# Altium schematic sheet 自平衡小车原理图.SchDoc: 自平衡小车
size A3; Author: 陈蔚
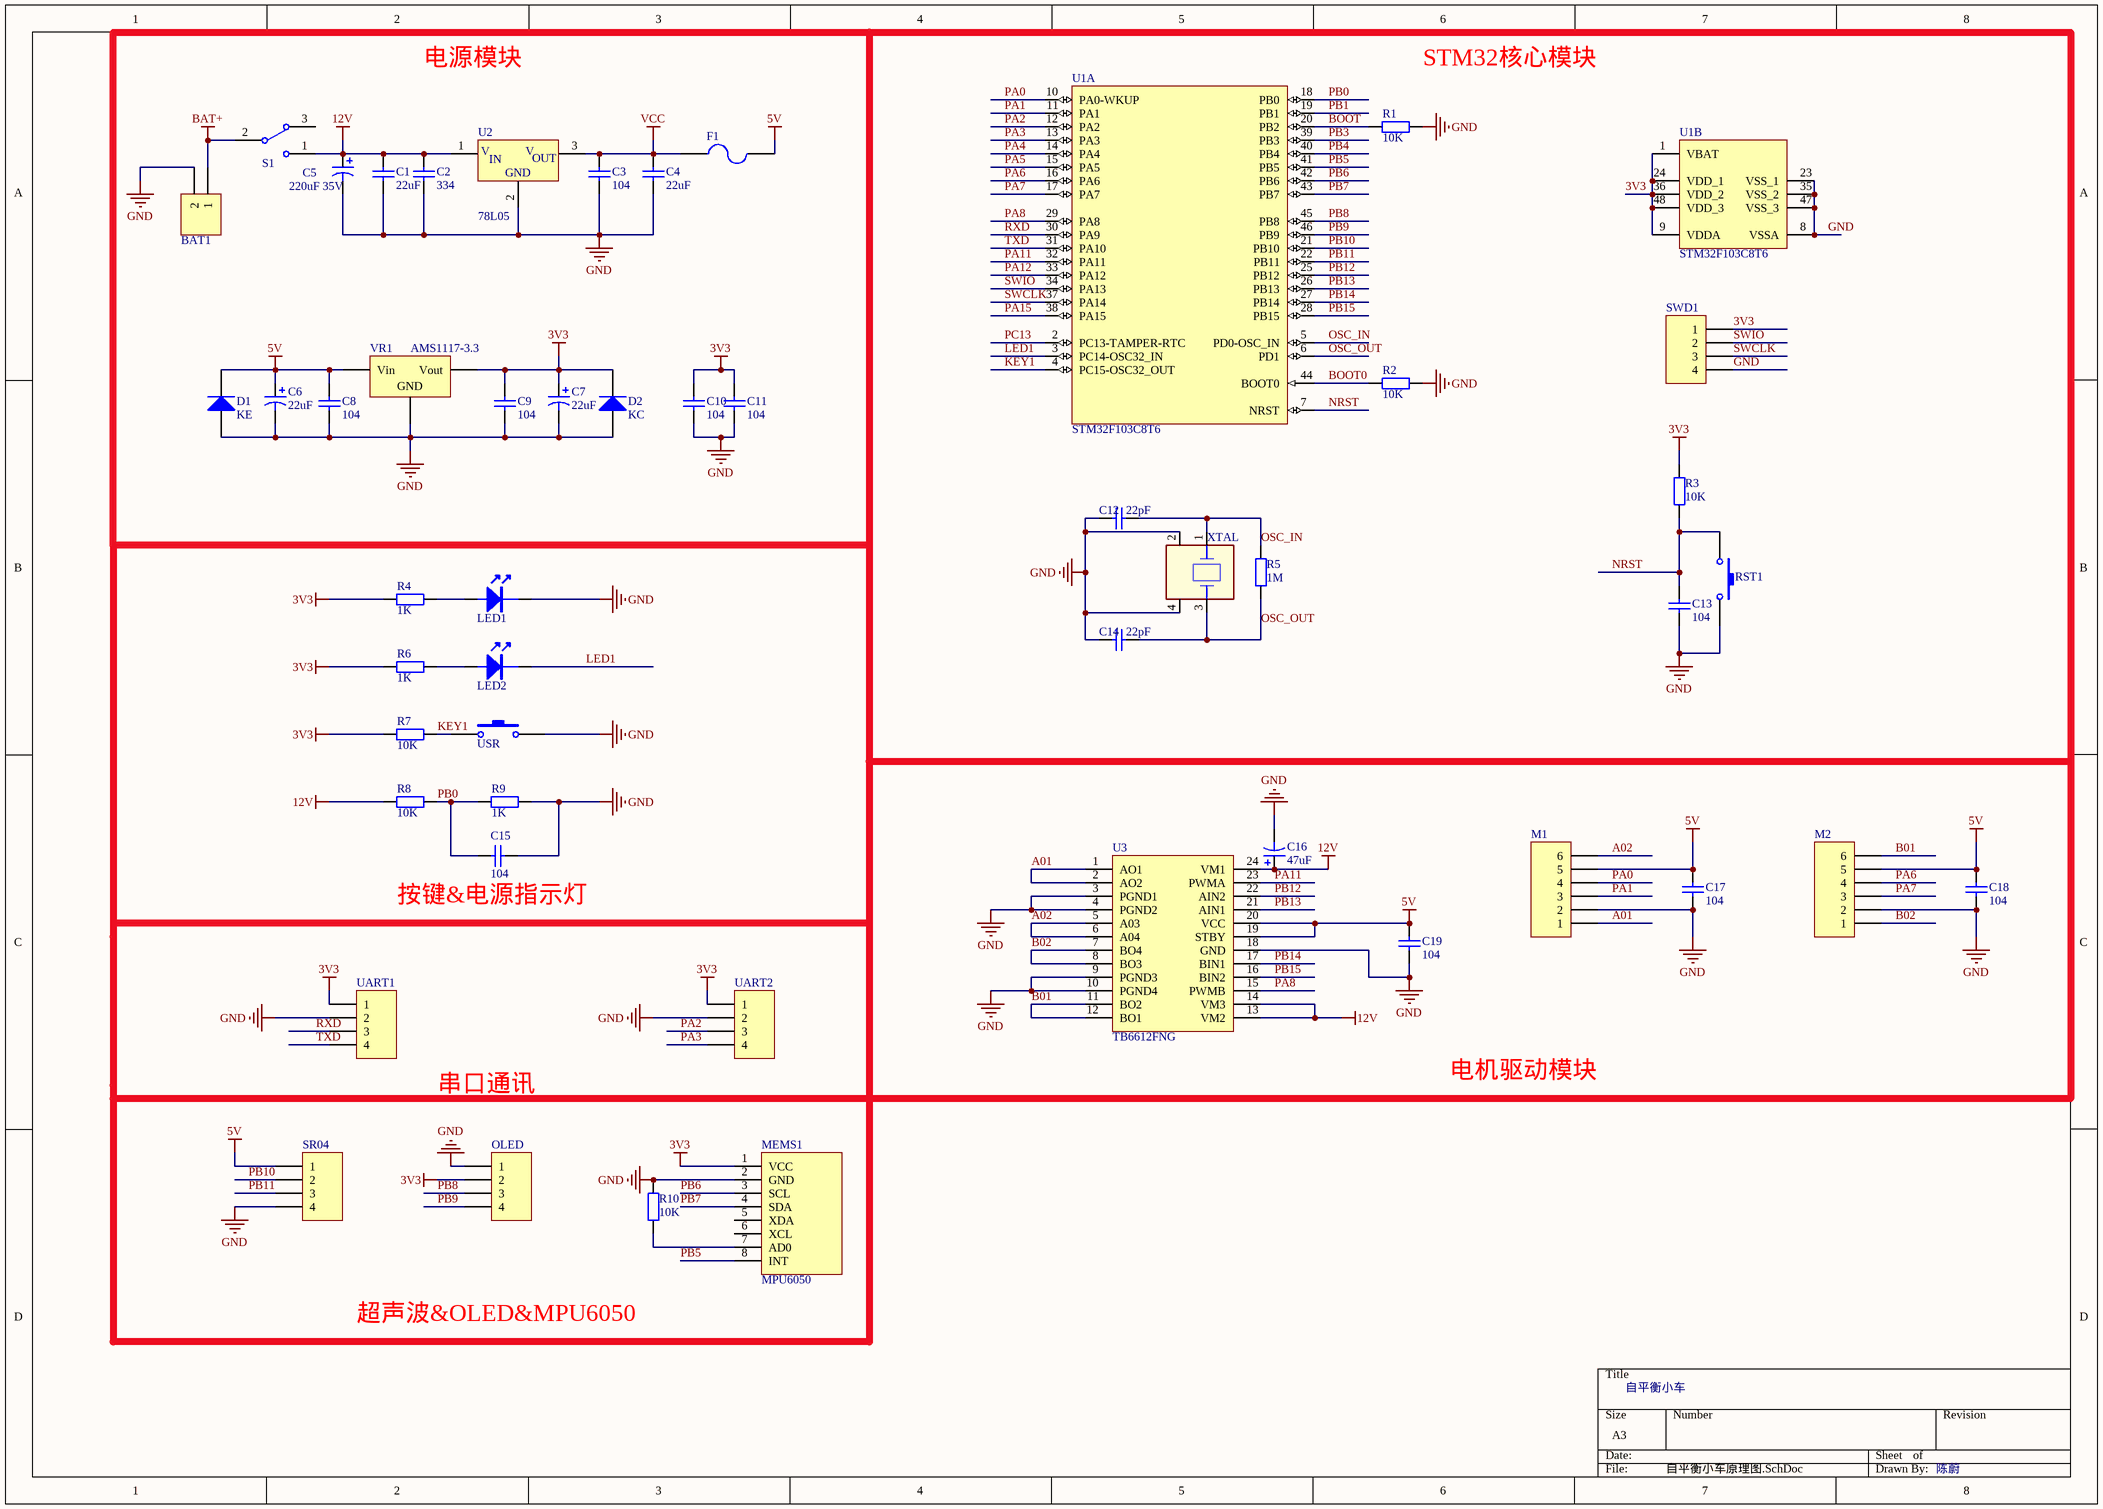
[diagram p0: 自平衡小车原理图.SchDoc]

## Parts
BAT1  Header 2  [XT30-PW-M]  (value not drawn)
C1  22uF  [0603_C_f]
C2  334  [0603_C_f]
C3  104  [0603_C_f]
C4  22uF  [0603_C_f]
C5  220uF 35V  [CM E(8*10.2)]
C6  value 22uF  [CD A(3216)]  (hidden comment: T22uF)
C7  value 22uF  [CD A(3216)]  (hidden comment: T22uF)
C8  104  [0603_C_f]
C9  104  [0603_C_f]
C10  104  [0603_C_f]
C11  104  [0603_C_f]
C12  22pF  [0603_C_f]
C13  104  [0603_C_f]
C14  22pF  [0603_C_f]
C15  104  [0603_C_f]
C16  47uF  [CM D(6.3*7.7)]
C17  104  [0603_C_f]
C18  104  [0603_C_f]
C19  104  [0603_C_f]
D1  KE  [SMB]
D2  KC  [SMB]
F1  F1  [0805_R]  (value not drawn)
LED1  LED  [LED-0603_GREEN]  (value not drawn)
LED2  LED  [LED-0603_GREEN]  (value not drawn)
M1  Header 6  [XH2.54-WI-6P]  (value not drawn)
M2  Header 6  [XH2.54-WI-6P]  (value not drawn)
MEMS1  MPU6050  [MPU6050]
OLED  Header 4  [HDR1X4]  (value not drawn)
R1  10K  [0603_R_F]
R2  10K  [0603_R_F]
R3  10K  [0603_R_F]
R4  1K  [0603_R_F]
R5  1M  [0603_R_F]
R6  1K  [0603_R_F]
R7  10K  [0603_R_F]
R8  10K  [0603_R_F]
R9  1K  [0603_R_F]
R10  10K  [0603_R_F]
RST1  SW-PB  [KEY]  (value not drawn)
S1  SW-SPDT  [SW-TH_SK-12D02-VG5]  (value not drawn)
SR04  Header 4  [HDR1X4]  (value not drawn)
SWD1  Header 4  [HDR1X4]  (value not drawn)
U1  STM32F103C8T6  [LQFP48 7X7_N]  (parts A,B of 2)
U2  78L05  [TO252]
U3  TB6612FNG  [SSOP-24_208mil]
UART1  Header 4  [HDR1X4]  (value not drawn)
UART2  Header 4  [HDR1X4]  (value not drawn)
USR  SW-PB  [KEY]  (value not drawn)
VR1  AMS1117-3.3  [SOT223_N]
XTAL  XTAL-4P  [OSC 3225-4P]  (value not drawn)

## Nets
3V3: C7.1 C9.2 C10.2 C11.2 D2.2(K) MEMS1.1(VCC) OLED.2 R3.2 R4.1 R6.1 R7.1 SWD1.1 U1.1(VBAT) U1.9(VDDA) U1.24(VDD_1) U1.36(VDD_2) U1.48(VDD_3) UART1.1 UART2.1 VR1.2(Vout)
5V: C6.1 C8.2 C17.2 C18.2 C19.2 D1.2(K) F1.2 M1.5 M2.5 SR04.1 U3.19(STBY) U3.20(VCC) VR1.3(Vin)
12V: C1.2 C2.2 C5.1 C16.1 R8.1 S1.1 U2.1(VIN) U3.13(VM2) U3.14(VM3) U3.24(VM1)
BAT+: BAT1.1 S1.2
GND: BAT1.2 C1.1 C2.1 C3.1 C4.1 C5.2 C6.2 C7.2 C8.1 C9.1 C10.1 C11.1 C12.1 C13.1 C14.1 C15.2 C16.2 C17.1 C18.1 C19.1 D1.1(A) D2.1(A) LED1.2 M1.2 M2.2 MEMS1.2(GND) OLED.1 R1.2 R2.2 R9.2 R10.2 RST1.2 SR04.4 SWD1.4 U1.8(VSSA) U1.23(VSS_1) U1.35(VSS_2) U1.47(VSS_3) U2.2(GND) U3.3(PGND1) U3.4(PGND2) U3.9(PGND3) U3.10(PGND4) U3.18(GND) UART1.2 UART2.2 USR.2 VR1.1(GND) XTAL.2 XTAL.4
VCC: C3.2 C4.2 F1.1 U2.3(VOUT)
A01: M1.1 U3.1(AO1) U3.2(AO2)
A02: M1.6 U3.5(A03) U3.6(A04)
B01: M2.6 U3.11(BO2) U3.12(BO1)
B02: M2.1 U3.7(BO4) U3.8(BO3)
BOOT: R1.1 U1.20(PB2)
BOOT0: R2.1 U1.44(BOOT0)
KEY1: R7.2 U1.4(PC15-OSC32_OUT) USR.1
LED1: LED2.2 U1.3(PC14-OSC32_IN)
NRST: C13.2 R3.1 RST1.1 U1.7(NRST)
OSC_IN: C12.2 R5.2 U1.5(PD0-OSC_IN) XTAL.1
OSC_OUT: C14.2 R5.1 U1.6(PD1) XTAL.3
PA0: M1.4 U1.10(PA0-WKUP)
PA1: M1.3 U1.11(PA1)
PA2: U1.12(PA2) UART2.3
PA3: U1.13(PA3) UART2.4
PA4: U1.14(PA4)
PA5: U1.15(PA5)
PA6: M2.4 U1.16(PA6)
PA7: M2.3 U1.17(PA7)
PA8: U1.29(PA8) U3.15(PWMB)
PA11: U1.32(PA11) U3.23(PWMA)
PA12: U1.33(PA12)
PA15: U1.38(PA15)
PB0: C15.1 R8.2 R9.1 U1.18(PB0)
PB1: U1.19(PB1)
PB3: U1.39(PB3)
PB4: U1.40(PB4)
PB5: MEMS1.8(INT) U1.41(PB5)
PB6: MEMS1.3(SCL) U1.42(PB6)
PB7: MEMS1.4(SDA) U1.43(PB7)
PB8: OLED.3 U1.45(PB8)
PB9: OLED.4 U1.46(PB9)
PB10: SR04.2 U1.21(PB10)
PB11: SR04.3 U1.22(PB11)
PB12: U1.25(PB12) U3.22(AIN2)
PB13: U1.26(PB13) U3.21(AIN1)
PB14: U1.27(PB14) U3.17(BIN1)
PB15: U1.28(PB15) U3.16(BIN2)
PC13: U1.2(PC13-TAMPER-RTC)
RXD: U1.30(PA9) UART1.3
SWCLK: SWD1.3 U1.37(PA14)
SWIO: SWD1.2 U1.34(PA13)
TXD: U1.31(PA10) UART1.4
NetLED1_1: LED1.1 R4.2
NetLED2_1: LED2.1 R6.2
NetMEMS1_7: MEMS1.7(AD0) R10.1

Not connected (* = marked no-connect by the designer): MEMS1 5(XDA) 6(XCL); S1 3

## Notes on the sheet
- 电源模块
- STM32核心模块
- (near C15) 按键&电源指示灯
- 串口通讯
- 电机驱动模块
- 超声波&OLED&MPU6050
- (in symbol 78L05) V; IN; OUT

## Library data of the parts
BAT1 = Header 2: Header, 2-Pin; LatestRevisionDate: 17-Jul-2002; LatestRevisionNote: Re-released for DXP Platform.; Publisher: Altium Limited
C1 C4 = 0805 22uF (226) 20% 25V: 贴片电容; ComponentLink1Description: 供应商链接; ComponentLink1URL: http://www.szlcsc.com/product/details_46786.html; Package: 0805; Supplier: LC; SuppliersPartNumber: C45783
C2 = 0603 100nF (104) 10% 50V_1: 贴片电容; ComponentLink1Description: 供应商链接; ComponentLink1URL: http://www.szlcsc.com/product/details_15331.html; Package: 0603; Supplier: LC; SuppliersPartNumber: C14663
C3 C8-C11 C13 C15 C17-C19 = 0603 100nF (104) 10% 50V: 贴片电容; ComponentLink1Description: 供应商链接; ComponentLink1URL: http://www.szlcsc.com/product/details_15331.html; Package: 0603; Supplier: LC; SuppliersPartNumber: C14663
C5 = Cap Pol1_1: Polarized Capacitor (Radial); Value: 100pF; Published: 8-Jun-2000; LatestRevisionDate: 17-Jul-2002; LatestRevisionNote: Re-released for DXP Platform.; PackageReference: RB7.6-15; Publisher: Altium Limited; PackageDescription: Polarized Capacitor (Radial); 2 Leads
C6 C7 = Cap Pol1_2: Polarized Capacitor (Radial); Published: 8-Jun-2000; LatestRevisionDate: 17-Jul-2002; LatestRevisionNote: Re-released for DXP Platform.; PackageReference: RB7.6-15; Publisher: Altium Limited; PackageDescription: Polarized Capacitor (Radial); 2 Leads
C12 C14 = 0603 22pF (220) 5% 50V: 贴片电容; ComponentLink1Description: 供应商链接; ComponentLink1URL: http://www.szlcsc.com/product/details_2005.html; Package: 0603; Supplier: LC; SuppliersPartNumber: C1653
C16 = Cap Pol1: Polarized Capacitor (Radial); Published: 8-Jun-2000; LatestRevisionDate: 17-Jul-2002; LatestRevisionNote: Re-released for DXP Platform.; PackageReference: RB7.6-15; Publisher: Altium Limited; PackageDescription: Polarized Capacitor (Radial); 2 Leads; Value: 47uF
D1 = Diode_1: Default Diode; Published: 8-Jun-2000; LatestRevisionDate: 17-Jul-2002; LatestRevisionNote: Re-released for DXP Platform.; PackageVersion: Sep-1996; PackageReference: SMC; Publisher: Altium Limited; PackageDescription: DO-214-AB/SMC; 2 C-Bend Leads; Body 7.9 x 5.9 mm, inc. leads (LxW); Code_JEDEC: DO-214-AB
D2 = Diode_2: Default Diode; Published: 8-Jun-2000; LatestRevisionDate: 17-Jul-2002; LatestRevisionNote: Re-released for DXP Platform.; PackageVersion: Sep-1996; PackageReference: SMC; Publisher: Altium Limited; PackageDescription: DO-214-AB/SMC; 2 C-Bend Leads; Body 7.9 x 5.9 mm, inc. leads (LxW); Code_JEDEC: DO-214-AB
F1 = Fuse 2: Fuse; Published: 8-Jun-2000; LatestRevisionDate: 17-Jul-2002; LatestRevisionNote: Re-released for DXP Platform.; PackageReference: PIN-W2/E2.8; Publisher: Altium Limited; PackageDescription: Thru-Hole; 2 Leads
M1 M2 = Header 6: Header, 6-Pin; LatestRevisionDate: 17-Jul-2002; LatestRevisionNote: Re-released for DXP Platform.; Publisher: Altium Limited
MEMS1 = GY-521
OLED SR04 UART1 UART2 = Header 4_1: Header, 4-Pin; LatestRevisionDate: 17-Jul-2002; LatestRevisionNote: Re-released for DXP Platform.; Publisher: Altium Limited
R1-R3 R7 R8 R10 = 0603 10KΩ (1002) 1%: 贴片电阻; ComponentLink1Description: 供应商链接; ComponentLink1URL: http://www.szlcsc.com/product/details_26547.html; Package: 0603; Supplier: LC; SuppliersPartNumber: C25804
R4 R6 R9 = 0603 1KΩ (1001) 1%: 贴片电阻; ComponentLink1Description: 供应商链接; ComponentLink1URL: http://www.szlcsc.com/product/details_21904.html; Package: 0603; Supplier: LC; SuppliersPartNumber: C21190
R5 = 0603 1MΩ (1004) 1%: 贴片电阻; ComponentLink1Description: 供应商链接; ComponentLink1URL: http://www.szlcsc.com/product/details_23662.html; Package: 0603; Supplier: LC; SuppliersPartNumber: C22935
RST1 USR = SW-PB: Switch; Published: 24-Mar-1999; LatestRevisionDate: 17-Jul-2002; LatestRevisionNote: Re-released for DXP Platform.; PackageReference: SPST-2; Publisher: Altium Limited; PackageDescription: Switch; 2 Leads
S1 = SW-SPDT: SPDT Subminiature Toggle Switch, Right Angle Mounting, Vertical Actuation; Published: 24-Mar-1999; LatestRevisionDate: 17-Dec-2003; LatestRevisionNote: Schematic revised, PCB Footprint replaced.; DatasheetVersion: 05-Dec-2000; PackageReference: TL36WW15050; Publisher: Altium Limited; PackageDescription: Switch; 4 Leads; ComponentLink1Description: Manufacturer Link; ComponentLink1URL: http://www.apem.com
SWD1 = Header 4: Header, 4-Pin; LatestRevisionDate: 17-Jul-2002; LatestRevisionNote: Re-released for DXP Platform.; Publisher: Altium Limited
U1 = STM32F103C8T6: ARM; ComponentLink1Description: 供应商链接; ComponentLink1URL: http://www.szlcsc.com/product/details_9243.html; Package: LQFP-48_7x7x05P; Supplier: LC; SuppliersPartNumber: C8734
U2 = 78L05: 3-Terminal Positive Voltage Regulator
VR1 = SOT-223 AMS1117-3.3: 低压差线性稳压(LDO); ComponentLink1Description: 供应商链接; ComponentLink1URL: http://www.szlcsc.com/product/details_6652.html; Package: SOT-223; Supplier: LC; SuppliersPartNumber: C6186